# EAGLE schematic avoccado-avr-pcb-felina-100x100 (EAGLE 7.2.0)
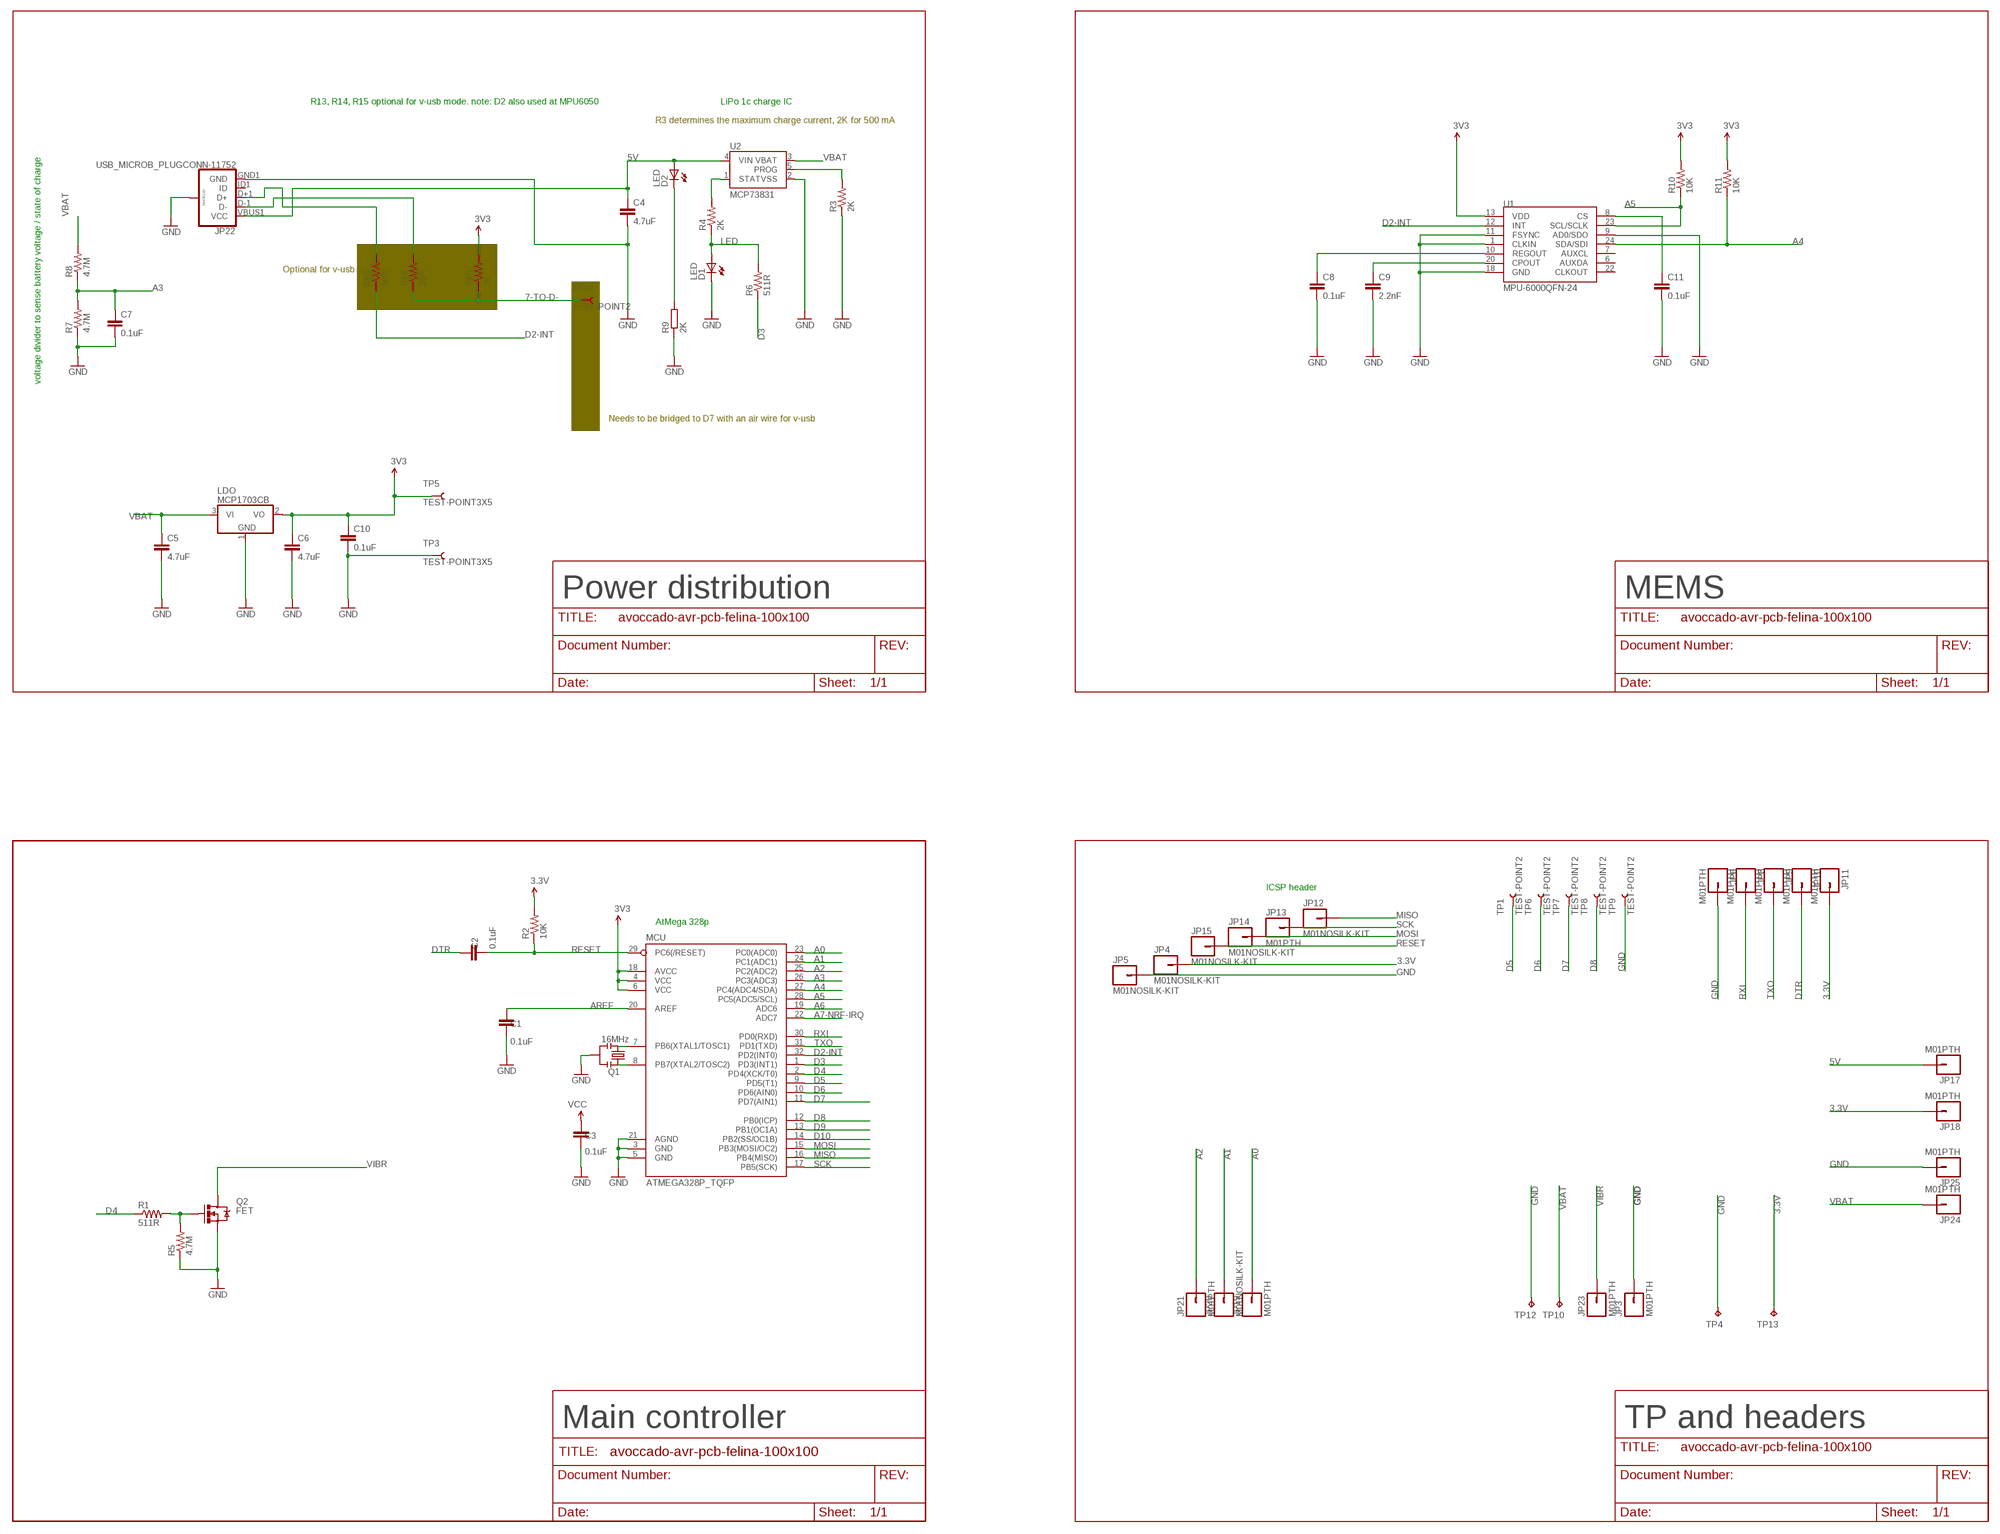
[diagram p0: schematic, sheet 1, part 1 of 2]
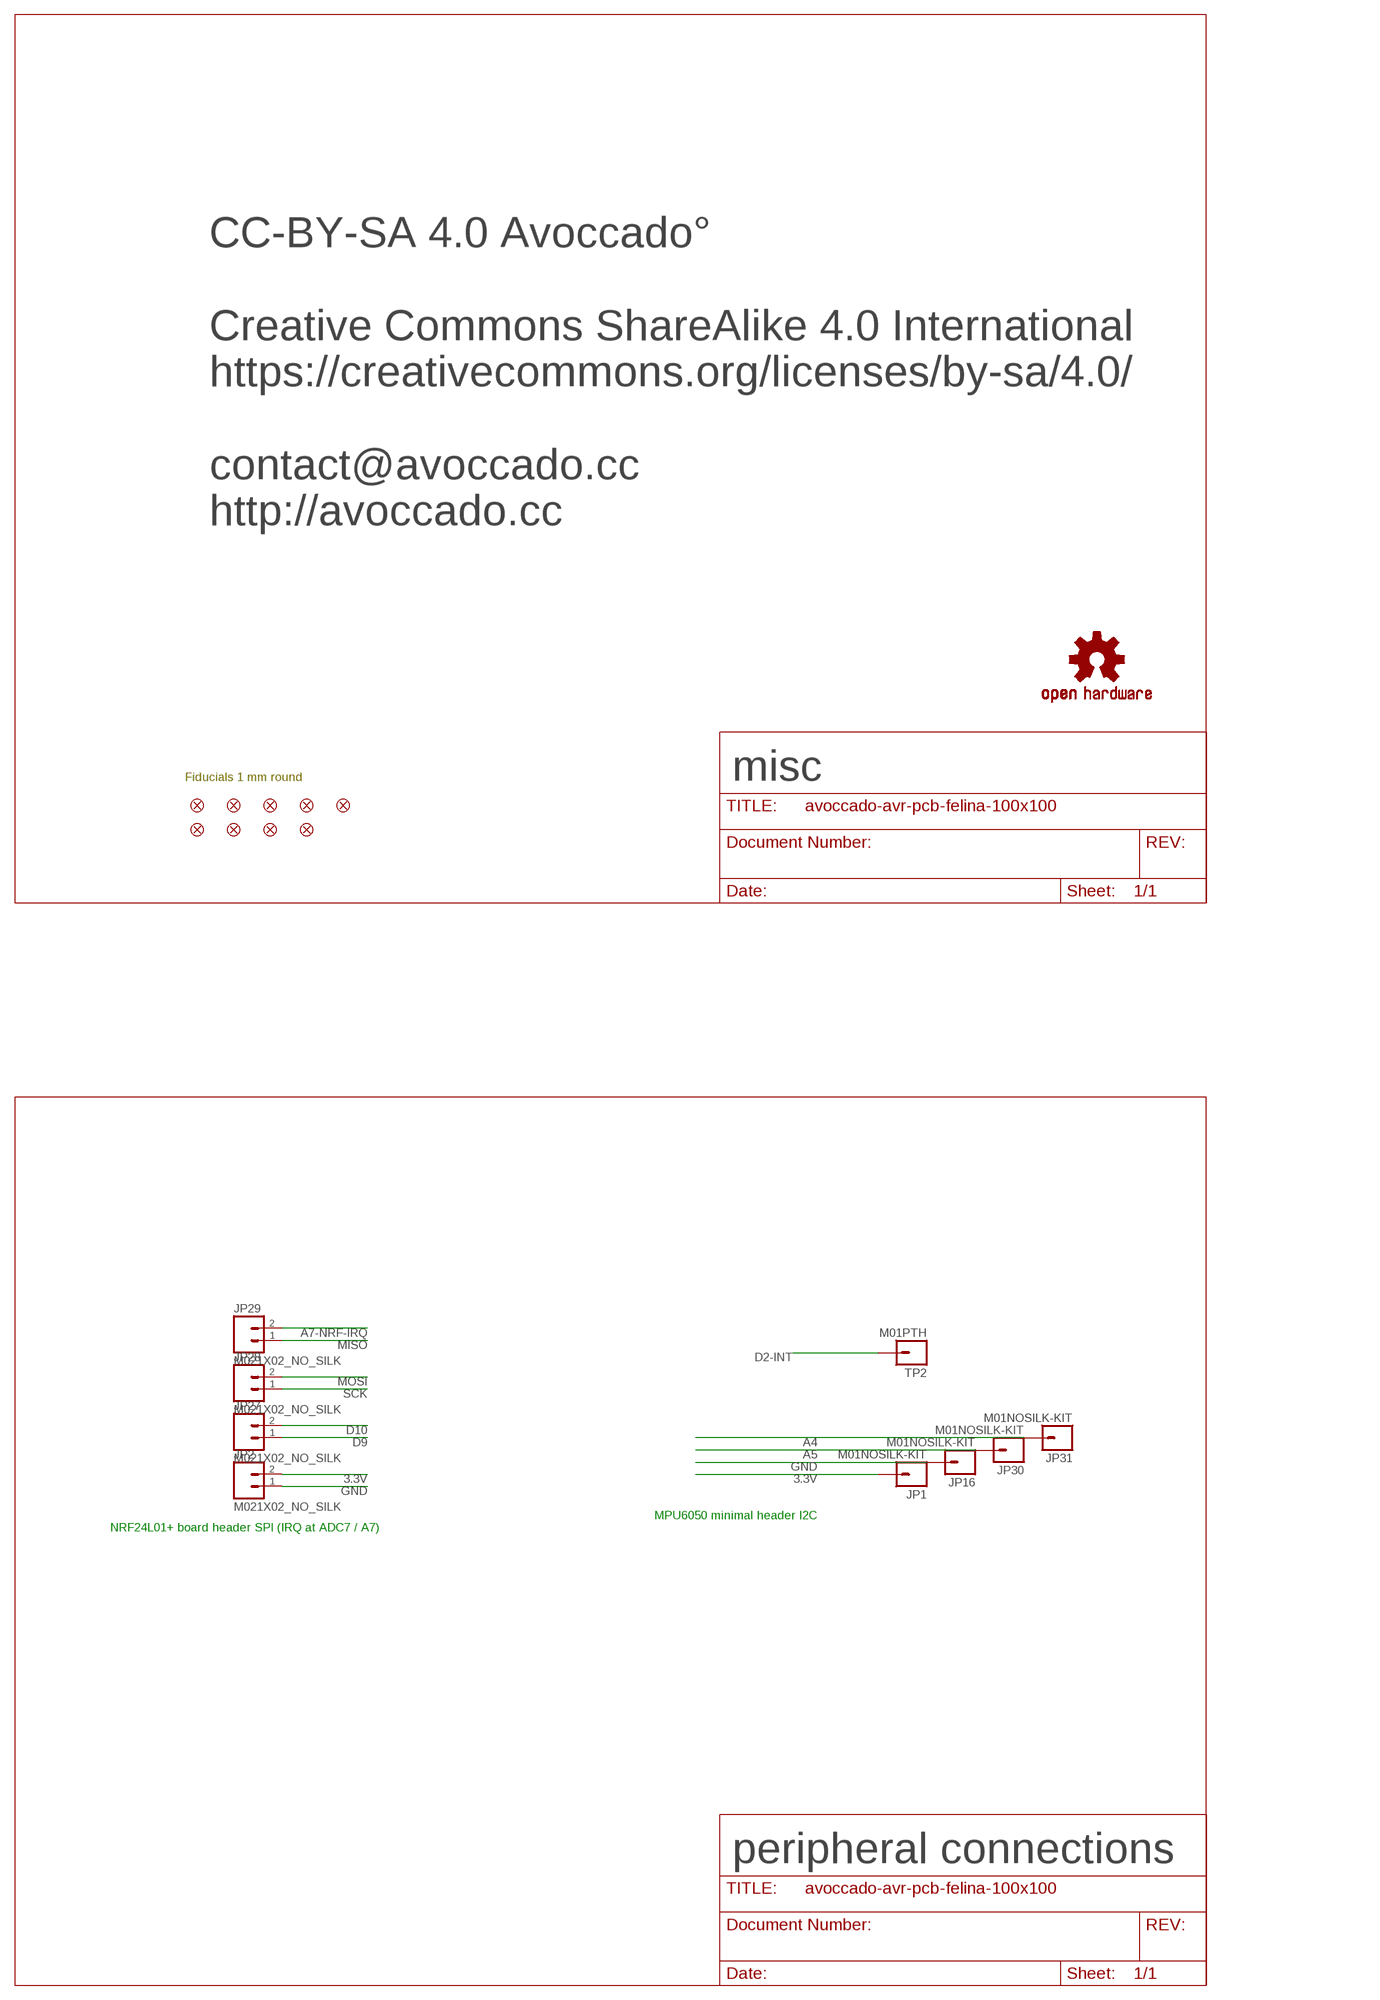
[diagram p1: schematic, sheet 1, part 2 of 2]

## Parts
C1  0.1uF  C-EUC0402K  [C0402K]
C2  0.1uF  C-EUC0402K  [C0402K]
C3  0.1uF  C-EUC0402K  [C0402K]
C4  4.7uF  4.7UF-6.3V-10%(0603)0603  [0603-CAP]
C5  4.7uF  4.7UF-6.3V-10%(0603)0603  [0603-CAP]
C6  4.7uF  4.7UF-6.3V-10%(0603)0603  [0603-CAP]
C7  0.1uF  C-EUC0402K  [C0402K]
C8  0.1uF  C-EUC0402K  [C0402K]
C9  2.2nF  C-EUC0402K  [C0402K]
C10  0.1uF  C-EUC0603  [C0603]
C11  0.1uF  C-EUC0402K  [C0402K]
D1  LED  LED0603  [LED-0603]
D2  LED  LED0603  [LED-0603]
FID1  FIDUCIALUFIDUCIAL  [MICRO-FIDUCIAL]
FID2  FIDUCIALUFIDUCIAL  [MICRO-FIDUCIAL]
FID3  FIDUCIALUFIDUCIAL  [MICRO-FIDUCIAL]
FID4  FIDUCIALUFIDUCIAL  [MICRO-FIDUCIAL]
FID5  FIDUCIALUFIDUCIAL  [MICRO-FIDUCIAL]
FID6  FIDUCIALUFIDUCIAL  [MICRO-FIDUCIAL]
FID7  FIDUCIALUFIDUCIAL  [MICRO-FIDUCIAL]
FID8  FIDUCIALUFIDUCIAL  [MICRO-FIDUCIAL]
FID9  FIDUCIALUFIDUCIAL  [MICRO-FIDUCIAL]
JP1  M01NOSILK-KIT  [1X01NS-KIT]
JP2  M021X02_NO_SILK  [1X02_NO_SILK]
JP3  M01PTH  [1X01]
JP4  M01NOSILK-KIT  [1X01NS-KIT]
JP5  M01NOSILK-KIT  [1X01NS-KIT]
JP6  M01PTH  [1X01]
JP8  M01PTH  [1X01]
JP9  M01PTH  [1X01]
JP10  M01PTH  [1X01]
JP11  M01PTH  [1X01]
JP12  M01NOSILK-KIT  [1X01NS-KIT]
JP13  M01PTH  [1X01]
JP14  M01NOSILK-KIT  [1X01NS-KIT]
JP15  M01NOSILK-KIT  [1X01NS-KIT]
JP16  M01NOSILK-KIT  [1X01NS-KIT]
JP17  M01PTH  [1X01]
JP18  M01PTH  [1X01]
JP19  M01PTH  [1X01]
JP20  M01NOSILK-KIT  [1X01NS-KIT]
JP21  M01PTH  [1X01]
JP22  USB_MICROB_PLUGCONN-11752  [USB-B-MICRO-SMD_V03]
JP23  M01PTH  [1X01]
JP24  M01PTH  [1X01]
JP25  M01PTH  [1X01]
JP27  M021X02_NO_SILK  [1X02_NO_SILK]
JP28  M021X02_NO_SILK  [1X02_NO_SILK]
JP29  M021X02_NO_SILK  [1X02_NO_SILK]
JP30  M01NOSILK-KIT  [1X01NS-KIT]
JP31  M01NOSILK-KIT  [1X01NS-KIT]
LDO  MCP1703CB  [SOT23]
LOGO1  OSHW-LOGOS  [OSHW-LOGO-S]
MCU  ATMEGA328P_TQFP  [TQFP32-08]
Q1  16MHz  RESONATORSMD  [RESONATOR-SMD]
Q2  FET  MOSFET-NCHANNELBSS123LT1G  [SOT23-3]
R1  511R  RESISTOR0603  [0603-RES]
R2  10K  RESISTOR0603  [0603-RES]
R3  2K  RESISTOR0603  [0603-RES]
R4  2K  RESISTOR0603  [0603-RES]
R5  4.7M  RESISTOR0603  [0603-RES]
R6  511R  RESISTOR0603  [0603-RES]
R7  4.7M  RESISTOR0603  [0603-RES]
R8  4.7M  RESISTOR0603  [0603-RES]
R9  2K  R-EU_R0402  [R0402]
R10  10K  RESISTOR0603  [0603-RES]
R11  10K  RESISTOR0603  [0603-RES]
R13  68R  RESISTOR0603  [0603-RES]
R14  68R  RESISTOR0603  [0603-RES]
R15  2K  RESISTOR0603  [0603-RES]
TP1  TEST-POINT2  [PAD.02X.02]
TP2  M01PTH  [1X01]
TP3  TEST-POINT3X5  [PAD.03X.05]
TP4  TPTP20R  [TP20R]
TP5  TEST-POINT3X5  [PAD.03X.05]
TP6  TEST-POINT2  [PAD.02X.02]
TP7  TEST-POINT2  [PAD.02X.02]
TP8  TEST-POINT2  [PAD.02X.02]
TP9  TEST-POINT2  [PAD.02X.02]
TP10  TPTP20R  [TP20R]
TP11  TEST-POINT2  [PAD.02X.02]
TP12  TPTP20R  [TP20R]
TP13  TPTP20R  [TP20R]
U1  MPU-6000QFN-24  [QFN-24-TESTING]
U2  MCP73831  [SOT23-5]

## Nets
3.3V: C3.2 C6.1 C10.1 JP1.1 JP2.2 JP4.1 JP11.1 JP18.1 LDO.2(VO) MCU.4(VCC) MCU.6(VCC) MCU.18(AVCC) R2.2 R10.2 R11.2 R15.2 TP5.P$1 TP13.TP U1.13(VDD) ; supply symbol labelled VCC, 3V3
5V: C4.1 D2.A JP17.1 JP22.VBUS1(VCC) U2.4(VIN)
7-TO-D-: R14.1 R15.1 TP11.P$1
A0: JP19.1 MCU.23(PC0(ADC0))
A1: JP20.1 MCU.24(PC1(ADC1))
A2: JP21.1 MCU.25(PC2(ADC2))
A3: C7.1 MCU.26(PC3(ADC3)) R7.2 R8.1
A4: JP31.1 MCU.27(PC4(ADC4/SDA)) R11.1 U1.24(SDA/SDI)
A5: JP30.1 MCU.28(PC5(ADC5/SCL)) R10.1 U1.23(SCL/SCLK)
A6: MCU.19(ADC6)
A7-NRF-IRQ: JP29.2 MCU.22(ADC7)
AREF: C1.2 MCU.20(AREF)
CHG-PROG: R3.2 U2.5(PROG)
D2-INT: MCU.32(PD2(INT0)) R13.1 TP2.1 U1.12(INT)
D3: MCU.1(PD3(INT1)) R6.1
D4: MCU.2(PD4(XCK/T0)) R1.1
D5: MCU.9(PD5(T1)) TP1.P$1
D6: MCU.10(PD6(AIN0)) TP6.P$1
D7: MCU.11(PD7(AIN1)) TP7.P$1
D8: MCU.12(PB0(ICP)) TP8.P$1
D9: JP27.1 MCU.13(PB1(OC1A))
D10: JP27.2 MCU.14(PB2(SS/OC1B))
DTR: C2.2 JP10.1
GND [vcc]: C1.1 C3.1 C4.2 C5.2 C6.2 C7.2 C8.2 C9.2 C10.2 C11.2 D1.C JP2.1 JP3.1 JP5.1 JP6.1 JP16.1 JP22.GND1(GND) JP22.SHIELD1(SHIELD) JP22.SHIELD2(SHIELD) JP22.SHIELD3(SHIELD) JP25.1 LDO.1(GND) MCU.3(GND) MCU.5(GND) MCU.21(AGND) Q1.2 Q2.2(S) R3.1 R5.1 R7.1 R9.1 TP3.P$1 TP4.TP TP9.P$1 TP12.TP U1.1(CLKIN) U1.9(AD0/SDO) U1.11(FSYNC) U1.18(GND) U2.2(VSS)
LED: D1.A R4.1 R6.2
MISO: JP12.1 JP29.1 MCU.16(PB4(MISO))
MOSI: JP14.1 JP28.2 MCU.15(PB3(MOSI/OC2))
N$1: MCU.8(PB7(XTAL2/TOSC2)) Q1.1
N$2: MCU.7(PB6(XTAL1/TOSC1)) Q1.3
N$3: D2.C R9.2
N$4: JP22.D+1(D+) R13.2
N$5: JP22.D-1(D-) R14.2
N$6: Q2.1(G) R1.2 R5.2
N$7: C8.1 U1.10(REGOUT)
N$8: C9.1 U1.20(CPOUT)
N$10: C11.1 U1.8(CS)
RESET: C2.1 JP15.1 MCU.29(PC6(/RESET)) R2.1
RXI: JP8.1 MCU.30(PD0(RXD))
SCK: JP13.1 JP28.1 MCU.17(PB5(SCK))
SOC: R4.2 U2.1(STAT)
TXO: JP9.1 MCU.31(PD1(TXD))
VBAT [vcc]: C5.1 JP24.1 LDO.3(VI) R8.2 TP10.TP U2.3(VBAT)
VIBR: JP23.1 Q2.3(D)
Unconnected: JP22.ID1(ID) U1.6(AUXDA) U1.7(AUXCL) U1.22(CLKOUT)

## Notes on the sheet
- R13, R14, R15 optional for v-usb mode. note: D2 also used at MPU6050 | LiPo 1c charge IC
- R3 determines the maximum charge current, 2K for 500 mA
- Optional for v-usb
- voltage divider to sense battery voltage / state of charge
- CC-BY-SA 4.0 Avoccado°
  
  Creative Commons ShareAlike 4.0 International
  https://creativecommons.org/licenses/by-sa/4.0/ 
  
  contact@avoccado.cc
  http://avoccado.cc
- Needs to be bridged to D7 with an air wire for v-usb
- Power distribution | MEMS | Fiducials 1 mm round | misc
- ICSP header
- AtMega 328p
- MPU6050 minimal header I2C
- NRF24L01+ board header SPI (IRQ at ADC7 / A7)
- Main controller | TP and headers | peripheral connections

## Library data of the parts
C1 C3 = resistor:C-EU: CAPACITOR, European symbol
C2 C7-C11 = rcl:C-EU: CAPACITOR, European symbol
C4-C6 = SparkFun-Capacitors:4.7UF-6.3V-10%(0603): CAP-08280; PROD_ID: CAP-08280
D1 D2 = SparkFun:LED: LEDs Standard schematic elements and footprints for 5mm, 3mm, 1206, and 0603 sized LEDs. 5mm - Spark Fun Electronics SKU : COM-00529 (and others)
FID1-FID9 = SparkFun-Aesthetics:FIDUCIAL: Fiducial Alignment Points Various fiducial points for machine vision alignment.
JP1 JP3-JP6 JP8-JP21 JP23-JP25 JP30 JP31 TP2 = SparkFun-Connectors:M01: Header 1 Standard 1-pin 0.1" header. Use with straight break away headers (SKU : PRT-00116), right angle break away headers (PRT-00553), swiss pins (PRT-00743), machine pins (PRT-00117), and female headers (PRT-00115).
JP2 JP27-JP29 = SparkFun-Connectors:M02: Standard 2-pin 0.1" header. Use with - straight break away headers ( PRT-00116) - right angle break away headers (PRT-00553) - swiss pins (PRT-00743) - machine pins (PRT-00117) - female headers (PRT-00115) Molex polarized connector foot print use with: PRT-08233 with associated crimp pins and housings. 2.54_SCREWTERM for use with PRT-10571. 3.5mm Screw Terminal footprints for PRT-08084 5mm Screw Terminal footprints for use with PRT-08432
JP22 = SparkFun-Connectors:USB_MICROB_PLUG: USB Micro-B connectors Some male, some female. Watch your step!; PROD_ID: CONN-11752
LDO = linear:MCP1703: 250 mA, 16V, Low Quiescent Current LDO Regulator Source: http://ww1.microchip.com/downloads/en/DeviceDoc/22049b.pdf
LOGO1 = SparkFun-Aesthetics:OSHW-LOGO: Open Source Hardware Logo This logo indicates the piece of hardware it is found on incorporates a OSHW license and/or adheres to the definition of open source hardware found here: http://freedomdefined.org/OSHW
MCU = SparkFun-DigitalIC:ATMEGA328P_TQFP; PROD_ID: IC-09069
Q1 = SparkFun:RESONATOR: Resonator Small SMD resonator. This is the itty bitty 10/20MHz resonators with built in caps. CSTCE10M0G55 and CSTCE20M0V53. Footprint has been reviewed closely but hasn't been tested yet.
Q2 = SparkFun-DiscreteSemi:MOSFET-NCHANNEL: Common NMOSFET Parts MFG P/N Store ID Prod ID FDD8780 TRANS-09984 SI7820DN TRANS-11055 FDS6630A IC-08089 2N7002PW TRANS-11151 FQP30N06L COM-10213 TRANS-10060 BSS123LT1G TRANS-08345 BSS138 TRANS-00830 BS170 2N7000; PROD_ID: TRANS-08345
R1-R8 R10 R11 R13-R15 = SparkFun-Resistors:RESISTOR: Resistor Basic schematic elements and footprints for 0603, 1206, and PTH resistors.
R9 = rcl:R-EU_: RESISTOR, European symbol
TP1 TP3 TP5-TP9 TP11 = SparkFun-Passives:TEST-POINT: Bare copper test points for troubleshooting or ICT
TP4 TP10 TP12 TP13 = testpad:TP: Test pad
U1 = SparkFun-Sensors:MPU-6000: MPU-6000 - I2C address is 0x68 with AD0 low and 0x69 with AD0 high.
U2 = SparkFun:MCP73831: Microchip's MCP73831 Miniature single cell, fully integrated Li-Ion, Li-polymer charge management controller http://ww1.microchip.com/downloads/en/DeviceDoc/21984a.pdf

## Net classes
1 vcc: width 0.203 mm
3 usbvcc: width 0.203 mm, drill 0.61 mm, clearance 0.152 mm